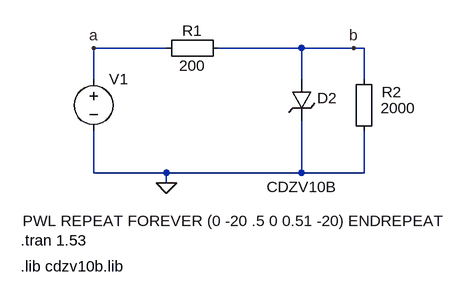
[diagram p0: schematic VL-P-N2.asc]
VL-P-N2.asc, the LTspice schematic file:
Version 4
SHEET 1 880 680
WIRE 48 112 -64 112
WIRE 256 112 128 112
WIRE 336 112 256 112
WIRE 352 112 336 112
WIRE -64 160 -64 112
WIRE 256 160 256 112
WIRE 352 160 352 112
WIRE -64 304 -64 240
WIRE 48 304 -64 304
WIRE 256 304 256 224
WIRE 256 304 48 304
WIRE 352 304 352 240
WIRE 352 304 256 304
WIRE 48 320 48 304
FLAG -64 112 a
FLAG 336 112 b
FLAG 48 320 0
SYMBOL Misc\\EuropeanResistor 144 96 R90
WINDOW 0 5 56 VBottom 2
WINDOW 3 27 56 VTop 2
SYMATTR InstName R1
SYMATTR Value 200
SYMBOL Misc\\EuropeanResistor 368 256 R180
WINDOW 0 -42 76 Left 2
WINDOW 3 -64 52 Left 2
SYMATTR InstName R2
SYMATTR Value 2000
SYMBOL voltage -64 144 R0
WINDOW 3 -109 234 Left 2
WINDOW 123 0 0 Left 2
WINDOW 39 0 0 Left 2
SYMATTR Value PWL REPEAT FOREVER (0 -20 .5 0 0.51 -20) ENDREPEAT
SYMATTR InstName V1
SYMBOL zener 240 160 R0
WINDOW 0 40 29 Left 2
WINDOW 3 -38 166 Left 2
SYMATTR InstName D2
SYMATTR Value CDZV10B
SYMATTR Description Diode
SYMATTR Type diode
TEXT -176 408 Left 2 !.tran 1.53
TEXT -176 448 Left 2 !.lib cdzv10b.lib

The netlist it stands for:
* VL-P-N2.asc
R1 b a 200
R2 0 b 2000
V1 a 0 PWL REPEAT FOREVER (0 -20 .5 0 0.51 -20) ENDREPEAT
D2 b 0 CDZV10B
.model D D
.lib standard.dio
.tran 1.53
.lib cdzv10b.lib
.backanno
.end